# Altium schematic sheet NAND.SchDoc
size A; SheetNumber: 5; SheetTotal: 7
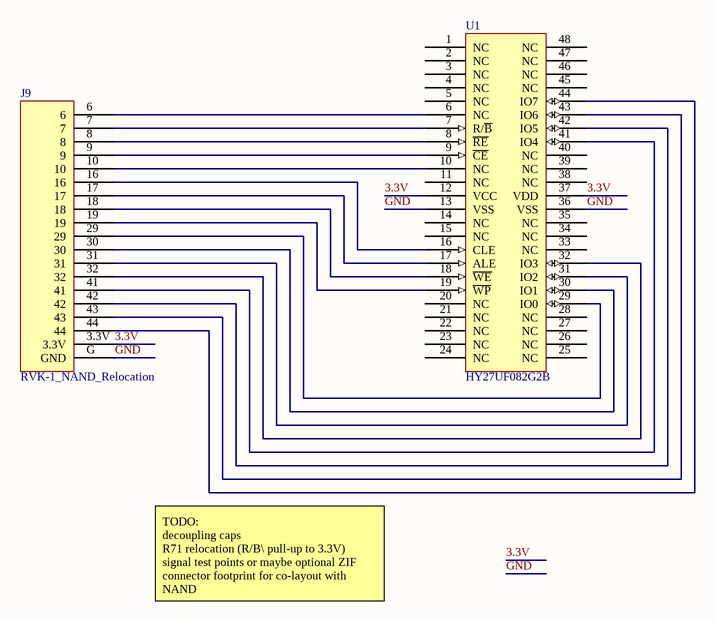
[diagram p0: NAND.SchDoc]

## Parts
J9  RVK-1_NAND_Relocation  [RVK-1_NAND_Vias]
U1  HY27UF082G2B  [TSSOP50P2000X120-48N]

## Nets
3.3V: J9.3.3V U1.12(VCC) U1.37(VDD)
GND: J9.G(GND) U1.13(VSS) U1.36(VSS)
NetJ9_6: J9.6 U1.6(NC)
NetJ9_7: J9.7 U1.7(R/~{B})
NetJ9_8: J9.8 U1.8(~{RE})
NetJ9_9: J9.9 U1.9(~{CE})
NetJ9_10: J9.10 U1.10(NC)
NetJ9_16: J9.16 U1.16(CLE)
NetJ9_17: J9.17 U1.17(ALE)
NetJ9_18: J9.18 U1.18(~{WE})
NetJ9_19: J9.19 U1.19(~{WP})
NetJ9_29: J9.29 U1.29(IO0)
NetJ9_30: J9.30 U1.30(IO1)
NetJ9_31: J9.31 U1.31(IO2)
NetJ9_32: J9.32 U1.32(IO3)
NetJ9_41: J9.41 U1.41(IO4)
NetJ9_42: J9.42 U1.42(IO5)
NetJ9_43: J9.43 U1.43(IO6)
NetJ9_44: J9.44 U1.44(IO7)

Not connected (* = marked no-connect by the designer): U1 1(NC) 2(NC) 3(NC) 4(NC) 5(NC) 11(NC) 14(NC) 15(NC) 20(NC) 21(NC) 22(NC) 23(NC) 24(NC) 25(NC) 26(NC) 27(NC) 28(NC) 33(NC) 34(NC) 35(NC) 38(NC) 39(NC) 40(NC) 45(NC) 46(NC) 47(NC) 48(NC)

## Notes on the sheet
- TODO:
  decoupling caps
  R71 relocation (R/B\ pull-up to 3.3V)
  signal test points or maybe optional ZIF connector footprint for co-layout with NAND

## Library data of the parts
U1 = HY27UF082G2B: NAND flash chip used on WII